# Altium schematic sheet Sturing_Temperatuur_Bout.SchDoc
size A4; SheetNumber: 3; SheetTotal: 4
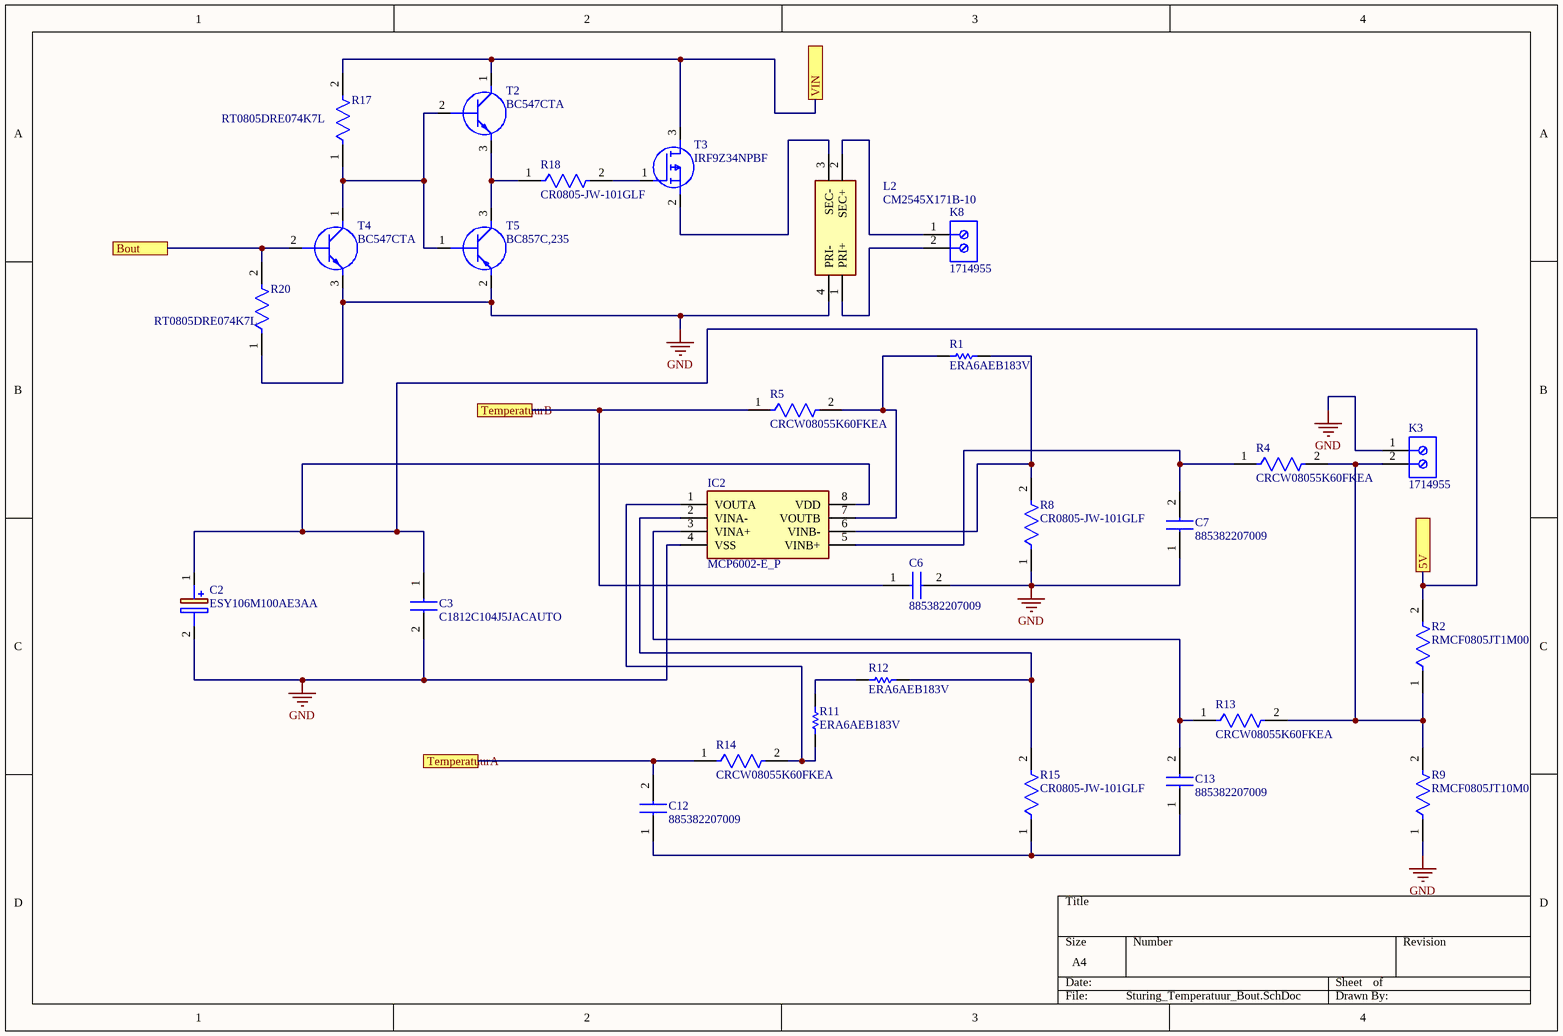
[diagram p0: Sturing_Temperatuur_Bout.SchDoc]

## Parts
C2  ESY106M100AE3AA  [CAPPRD250W50D630H1250]
C3  C1812C104J5JACAUTO  [CAPC4532X110N]
C6  885382207009  [CAPC2012X135N]
C7  885382207009  [CAPC2012X135N]
C12  885382207009  [CAPC2012X135N]
C13  885382207009  [CAPC2012X135N]
IC2  MCP6002-E_P  [DIP781W56P254L950H533Q8N]
K3  1714955  [PHOE-1714955_V]
K8  1714955  [PHOE-1714955_V]
L2  CM2545X171B-10  [CM2545X171B10]
R1  ERA6AEB183V  [RESC2013X60X40LL20T25]
R2  RMCF0805JT1M00  [FP-RMCF0805-IPC_C]
R4  CRCW08055K60FKEA  [FP-CRCW0805-e3-IPC_A]
R5  CRCW08055K60FKEA  [FP-CRCW0805-e3-IPC_A]
R8  CR0805-JW-101GLF  [FP-CR0805-IPC_A]
R9  RMCF0805JT10M0  [FP-RMCF0805-IPC_A]
R11  ERA6AEB183V  [RESC2013X60X40LL20T25]
R12  ERA6AEB183V  [RESC2013X60X40LL20T25]
R13  CRCW08055K60FKEA  [FP-CRCW0805-e3-IPC_A]
R14  CRCW08055K60FKEA  [FP-CRCW0805-e3-IPC_A]
R15  CR0805-JW-101GLF  [FP-CR0805-IPC_A]
R17  RT0805DRE074K7L  [FP-RT0805-MFG]
R18  CR0805-JW-101GLF  [FP-CR0805-IPC_A]
R20  RT0805DRE074K7L  [FP-RT0805-MFG]
T2  BC547CTA  [MC79L15ACPG]
T3  IRF9Z34NPBF  [TO254P469X1042X1967-3P]
T4  BC547CTA  [MC79L15ACPG]
T5  BC857C,235  [SOT95P230X110-3N]

## Ports
5V, Bout, TemperatuurA, TemperatuurB, VIN

## Nets
GND: C2.2(-) C3.2 C6.2 C7.1 IC2.4(VSS) K3.1 L2.4(PRI-) R8.1 R9.1 R20.1 T4.3(E) T5.2(E)
5V: C2.1(+) C3.1 IC2.8(VDD) R2.2 ; port 5V
Bout: R20.2 T4.2(B) ; port Bout
TemperatuurA: C12.2 R14.1 ; port TemperatuurA
TemperatuurB: C6.1 R5.1 ; port TemperatuurB
VIN: R17.2 T2.1(C) T3.3(D) ; port VIN
NetC7_2: C7.2 IC2.5(VINB+) R4.1
NetC12_1: C12.1 C13.1 R15.1
NetC13_2: C13.2 IC2.3(VINA+) R13.1
NetIC2_1: IC2.1(VOUTA) R11.1 R14.2
NetIC2_2: IC2.2(VINA-) R12.2 R15.2
NetIC2_6: IC2.6(VINB-) R1.2 R8.2
NetIC2_7: IC2.7(VOUTB) R1.1 R5.2
NetK3_2: K3.2 R2.1 R4.2 R9.2 R13.2
NetK8_1: K8.1 L2.2(SEC+)
NetK8_2: K8.2 L2.1(PRI+)
NetL2_3: L2.3(SEC-) T3.2(S)
NetR11_2: R11.2 R12.1
NetR17_1: R17.1 T2.2(B) T4.1(C) T5.1(B)
NetR18_1: R18.1 T2.3(E) T5.3(C)
NetR18_2: R18.2 T3.1(G)

## Library data of the parts
C2 = ESY106M100AE3AA: Capacitor Polarised; Manufacturer_Name: Kemet; Datasheet Link: https://connect.kemet.com:7667/gateway/IntelliData-ComponentDocumentation/1.0/download/specsheet/ESY106M100AE3AA; Height: 12.5mm; Manufacturer_Part_Number: ESY106M100AE3AA
C3 = C1812C104J5JACAUTO: Capacitor; Manufacturer_Name: Kemet; Datasheet Link: https://www.mouser.co.uk/ProductDetail/KEMET/C1812C104J5JACAUTO?qs=sGAEpiMZZMuMW9TJLBQkXk76meUxNvf1WfCyyeF%2F6yU%3D; Height: 1.1mm; Manufacturer_Part_Number: C1812C104J5JACAUTO
C6 C7 C12 C13 = 885382207009: Capacitor; Manufacturer_Name: Wurth Elektronik; Datasheet Link: https://katalog.we-online.com/pbs/datasheet/885382207009.pdf; Height: 1.35mm; Manufacturer_Part_Number: 885382207009
IC2 = MCP6002-E_P: Integrated Circuit; Manufacturer_Name: Microchip; Manufacturer_Part_Number: MCP6002-E/P; Datasheet Link: https://componentsearchengine.com//MCP6002-E_P.pdf; Height: 5.334mm; Mouser2 Part Number: 579-MCP6002-E/P; Mouser2 Price/Stock: https://www.mouser.com/Search/Refine.aspx?Keyword=579-MCP6002-E%2FP
K3 K8 = CMP-2000-05797-1: PC Terminal Block, Pitch 6.35 mm, 1 x 2 Position, Height 21.5 mm, Tail Lenght 5.1 mm, RoHS, Bulk; Manufacturer: Phoenix Contact; Package Description: PC Terminal Block, Pitch 6.35 mm, 1 x 2 Position, Height 21.5 mm, Tail Lenght 5.1 mm; Datasheet URL: http://media.digikey.com/pdf/Data%20Sheets/Phoenix%20Contact%20PDFs/1714955.pdf; Package Reference: 1714955; Manufacturer URL: http://www.phoenixcontact.com/; Datasheet Version: 02/2010; Mounting Technology: ThroughHole
L2 = CM2545X171B-10: Transformer; Manufacturer_Name: Laird Technologies; Datasheet Link: https://datasheet.datasheetarchive.com/originals/dk/DKDS-7/122753.pdf; Height: 9.5mm; Manufacturer_Part_Number: CM2545X171B-10
R1 R11 R12 = CMP-2001-00606-1: Manufacturer: Panasonic; Part Number: ERA6AEB183V
R2 = CMP-26527-000066-1: 1MΩ ±5% 0.125W 0805 Thick Film Chip Resistor AEC-Q200 compliant; Temperature Coefficient: 200ppm/°C; Max Power Dissipation: 125mW; Resistance: 1MR; Construction: Rectangular; Case Code (Metric): 2012; Radiation Hardening: No; Contact Plating: Tin; Military Standard: Not; Features: Automotive AEC-Q200; Resistor Type: Thick Film; Series: RMCF; Length: 2mm; Min Operating Temperature: -55°C; Case Code (Imperial): 0805; Height: 0.026inch; Mount: Surface Mount; Max Operating Temperature: 155°C; Depth: 1.25mm; Width: 0.049inch; Packaging: Tape and Reel; Number of Terminations: 2; Case/Package: 0805; Tolerance: 5%; Lead Free: Lead Free; RoHS Compliant: Yes
R4 R5 R13 R14 = CMP-2001-04030-2: RES Thick Film, 5.6kΩ, 1%, 0.125W, 100ppm/°C, 0805; Resistance: 5.6kR; Voltage Rating: 150V; Max Power Dissipation: 125mW; Case Code (Imperial): 0805; Features: Automotive AEC-Q200; Composition: Thick Film; Package Quantity: 1; Mount: Surface Mount; Tolerance: 1%; Radiation Hardening: No; Length: 2mm; Case Code (Metric): 2012; Temperature Coefficient: 100ppm/°C; Power Rating: 125mW; Number of Terminations: 2; Lead Free: Lead Free; Voltage Rating (DC): 150V; Military Standard: Not; Number of Pins: 2; Height: 0.45mm; Depth: 1.25mm; Weight: 0.000194oz; Packaging: Tape and Reel; Case/Package: 0805; Contact Plating: Tin; Min Operating Temperature: -55°C; Termination: SMD/SMT; Max Operating Temperature: 155°C; Width: 1.25mm
R8 R15 R18 = CMP-07231-005410-1: Thick Film Chip Resistors 0805 100Ω 0.125W 5% 200ppm/°C; Voltage Rating: 150V; Resistance: 100R; Max Power Dissipation: 125mW; Composition: Thick Film; Height: 0.024inch; Mount: Surface Mount; Min Operating Temperature: -55°C; Case/Package: 0805; Depth: 1.25mm; Number of Terminations: 2; Features: Moisture Resistant; Thickness: 508um; Temperature Coefficient: 200ppm/°C; Contact Plating: Tin; Length: 0.079inch; Max Operating Temperature: 155°C; Tolerance: 5%; Case Code (Metric): 2012; Width: 0.049inch; Case Code (Imperial): 0805; Power Rating: 125mW; Packaging: Tape and Reel; Termination: SMD/SMT; Package Quantity: 10000; Radiation Hardening: No; Military Standard: Not
R9 = CMP-26527-000232-1: 10MΩ ±5% 0.125W 0805 Thick Film Chip Resistor AEC-Q200 compliant; Power Rating: 125mW; Temperature Coefficient: 200ppm/°C; Resistance: 10MR; Size Code: 0805; Resistor Type: Thick Film; RoHS Compliant: Yes; Max Operating Temperature: 155°C; Width: 0.049inch; Case/Package: 0805; Military Standard: Not; Max Power Dissipation: 125mW; Length: 2mm; Min Operating Temperature: -55°C; Tolerance: 5%; Height: 0.026inch; Depth: 1.25mm; Construction: Rectangular; Mount: Surface Mount; Radiation Hardening: No; Contact Plating: Tin; Case Code (Metric): 2012; Features: Automotive AEC-Q200; Case Code (Imperial): 0805; Packaging: Tape and Reel; Number of Terminations: 2; Lead Free: Lead Free; Series: RMCF
R17 R20 = CMP-03412-005354-1: RES SMD 4.7K OHM 0.5% 1/8W 0805; Manufacturer: Yageo; Value: 4.7KΩ; Power Rating: 0.125W; Tolerance: 0.01; Voltage Rating: 150V; Temperature Coefficient: 50 ppm/°C; Lead Free: Yes; Device Class L2: Resistors; ComponentLink2Description: Datasheet; RoHS: TRUE; Package: RT0805; Resistance: 4.7KΩ; Device Class L3: Chip SMD Resistors; Ipc Land Pattern Name: RESC200125X50; Category: Res; Octopart: https://octopart.com/rt0805dre074k7l-yageo-1242027; Temperature: -55°C to +155°C; Temperature Range High: +155°C; Digikey Description: RES SMD 4.7K OHM 0.5% 1/8W 0805; Series: RT; Height: 0.6mm; Footprint Url: http://www.yageo.com/exep/pages/download/literatures/PYu-R_Mount_10.pdf; Device Class L1: Passive Components; Temperature Range Low: -55°C; Composition: Thin Film; Manufacturer Part Number: RT0805DRE074K7L; ComponentLink2URL: http://www.yageo.com/documents/recent/PYu-RT_1-to-0.01_RoHS_L_9.pdf; Automotive: No
T2 T4 = BC547CTA: Transistor BJT NPN; Manufacturer_Name: ON Semiconductor; Datasheet Link: http://www.onsemi.com/pub/Collateral/BC550-D.pdf; Manufacturer_Part_Number: BC547CTA
T3 = IRF9Z34NPBF: MOSFET (P-Channel); Manufacturer_Name: Infineon; Datasheet Link: https://componentsearchengine.com//IRF9Z34NPBF.pdf; Height: 4.69mm; Mouser2 Part Number: 942-IRF9Z34NPBF; Mouser2 Price/Stock: https://www.mouser.com/Search/Refine.aspx?Keyword=942-IRF9Z34NPBF; Manufacturer_Part_Number: IRF9Z34NPBF
T5 = BC857C,235: Transistor BJT PNP; Manufacturer_Name: Nexperia; Datasheet Link: https://componentsearchengine.com//BC857C,235.pdf; Height: 1.1mm; Mouser2 Part Number: 771-BC857C235; Mouser2 Price/Stock: https://www.mouser.com/Search/Refine.aspx?Keyword=771-BC857C235; Manufacturer_Part_Number: BC857C,235